# EAGLE design v1garagedoor (EAGLE 7.4.0)
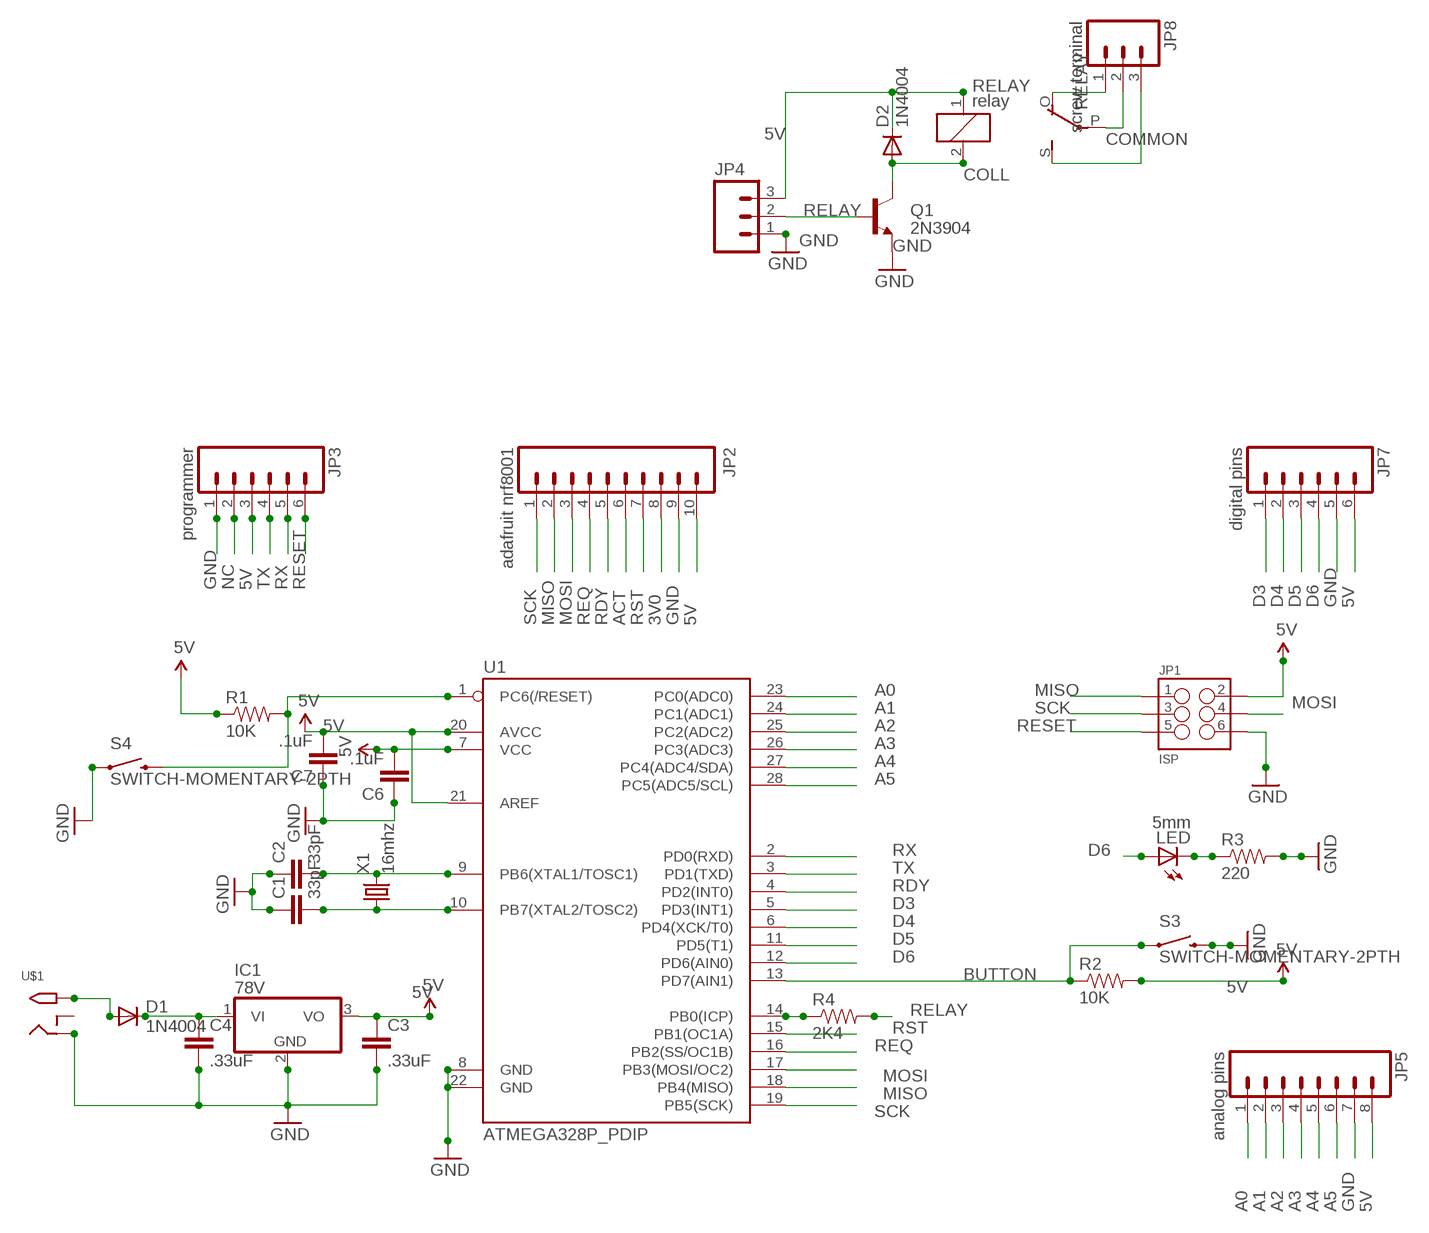
[diagram p0: schematic, sheet 1]

## Parts
C1  33pF  CAPPTH1  [CAP-PTH-5MM]
C2  33pF  CAPPTH1  [CAP-PTH-5MM]
C3  .33uF  CAPKIT  [CAP-PTH-SMALL-KIT]
C4  .33uF  CAPKIT  [CAP-PTH-SMALL-KIT]
C6  .1uF  CAPKIT  [CAP-PTH-SMALL-KIT]
C7  .1uF  CAPKIT  [CAP-PTH-SMALL-KIT]
D1  1N4004  [DO41-10]
D2  1N4004  [DO41-10]
IC1  78V  [TO220V]
JP1  ISP  M03X2NO_SILK  [2X3-NS]
JP2  adafruit nrf8001  M10SILK_FEMALE_PTH  [1X10]
JP3  programmer  M06NO_SILK_FEMALE_PTH  [1X06_NO_SILK]
JP4  M03LOCK  [1X03_LOCK]
JP5  analog pins  M08SILK_FEMALE_PTH  [1X08]
JP7  digital pins  M06NO_SILK_FEMALE_PTH  [1X06_NO_SILK]
JP8  screw terminal  M03SCREW  [SCREWTERMINAL-3.5MM-3]
LED  5mm  LED5MM  [LED5MM]
Q1  2N3904  TRANSISTOR_NPN2N3904  [TO-92]
R1  10K  RESISTORAXIAL-0.3  [AXIAL-0.3]
R2  10K  RESISTORAXIAL-0.3  [AXIAL-0.3]
R3  220  RESISTORAXIAL-0.3  [AXIAL-0.3]
R4  2K4  RESISTORAXIAL-0.3  [AXIAL-0.3]
RELAY  relay  ZF112  [ZF112]
S3  SWITCH-MOMENTARY-2PTH  [TACTILE-PTH]
S4  SWITCH-MOMENTARY-2PTH  [TACTILE-PTH]
U1  ATMEGA328P_PDIP  [DIL28-3]
U$1  2.1MMJACKTHM  [PJ-102A]
X1  16mhz  CRYSTALTC38H  [TC38H]

## Nets
3V0: JP2.8
5V: C3.1 C6.2 C7.2 D2.C IC1.3(VO) JP1.2 JP2.10 JP3.3 JP4.3 JP5.8 JP7.6 R1.P$1 R2.P$2 RELAY.1 U1.7(VCC) U1.20(AVCC) U1.21(AREF)
12V: D1.A U$1.TIP
A0: JP5.1 U1.23(PC0(ADC0))
A1: JP5.2 U1.24(PC1(ADC1))
A2: JP5.3 U1.25(PC2(ADC2))
A3: JP5.4 U1.26(PC3(ADC3))
A4: JP5.5 U1.27(PC4(ADC4/SDA))
A5: JP5.6 U1.28(PC5(ADC5/SCL))
ACT: JP2.6
BUTTON: R2.P$1 S3.1 U1.13(PD7(AIN1))
COLL: D2.A Q1.3(C) RELAY.2
COMMON: JP8.2 RELAY.P(2:P)
D3: JP7.1 U1.5(PD3(INT1))
D4: JP7.2 U1.6(PD4(XCK/T0))
D5: JP7.3 U1.11(PD5(T1))
D6: JP7.4 LED.A U1.12(PD6(AIN0))
GND: C1.1 C2.1 C3.2 C4.2 C6.1 C7.1 IC1.2(GND) JP1.6 JP2.9 JP3.1 JP4.1 JP5.7 JP7.5 Q1.1(E) R3.P$2 S3.3 S4.1 U1.8(GND) U1.22(GND) U$1.RING
MISO: JP1.1 JP2.2 U1.18(PB4(MISO))
MOSI: JP1.4 JP2.3 U1.17(PB3(MOSI/OC2))
N$1: C2.2 U1.9(PB6(XTAL1/TOSC1)) X1.2
N$2: C1.2 U1.10(PB7(XTAL2/TOSC2)) X1.1
N$3: C4.1 D1.C IC1.1(VI)
N$4: LED.K(C) R3.P$1
N$5: JP8.1 RELAY.O(2:O)
N$6: JP8.3 RELAY.S(2:S)
N$7: R4.P$1 U1.14(PB0(ICP))
NC: JP3.2
RDY: JP2.5 U1.4(PD2(INT0))
RELAY: JP4.2 Q1.2(B) R4.P$2
REQ: JP2.4 U1.16(PB2(SS/OC1B))
RESET: JP1.5 JP3.6 R1.P$2 S4.3 U1.1(PC6(/RESET))
RST: JP2.7 U1.15(PB1(OC1A))
RX: JP3.5 U1.2(PD0(RXD))
SCK: JP1.3 JP2.1 U1.19(PB5(SCK))
TX: JP3.4 U1.3(PD1(TXD))
Unconnected: U$1.RING_SW

## Library data of the parts
C1 C2 = SparkFun-Capacitors:CAP: Capacitor Standard 0603 ceramic capacitor, and 0.1" leaded capacitor.; MOUSER: 594-S200K25SL0N63L6R
C3 C4 C6 C7 = SparkFun-Capacitors:CAP: Capacitor Standard 0603 ceramic capacitor, and 0.1" leaded capacitor.; MOUSER: 810-FK18X5R1A334K
D1 D2 = adafruit:1N4004: DIODE General purpose 1N400x type rectifier (With bigger pads) http://www.ladyada.net/library/pcb/eaglelibrary.html; MOUSER: 621-1N4004
IC1 = adafruit:78*: Positive VOLTAGE REGULATOR Added bigger pads to the TO-92 package; MOUSER: 863-MC7805CTG
JP1 = SparkFun-Connectors:M03X2: 2x3 .1" header. Shrouded, with keying- CONN-10681 SMT- CONN-11415 Pogo pins- HW-11044; MOUSER: 571-5-146252-3
JP2 = SparkFun-Connectors:M10: Header 10 Standard 10-pin 0.1" header. Use with straight break away headers (SKU : PRT-00116), right angle break away headers (PRT-00553), swiss pins (PRT-00743), machine pins (PRT-00117), and female headers (PRT-00115).; MOUSER: 992-10FX1-254MM; PROD_ID: CONN-11563
JP3 JP7 = SparkFun-Connectors:M06: Header 6 Standard 6-pin 0.1" header. Use with straight break away headers (SKU : PRT-00116), right angle break away headers (PRT-00553), swiss pins (PRT-00743), machine pins (PRT-00117), and female headers (PRT-00115). Molex polarized connector foot print use with SKU : PRT-08094 with associated crimp pins and housings. NOTES ON THE VARIANTS LOCK and LOCK_LONGPADS... This footprint was designed to help hold the alignment of a through-hole component (i.e. 6-pin header) while soldering it into place. You may notice that each hole has been shifted either up or down by 0.005 of an inch from it's more standard position (which is a perfectly straight line). This slight alteration caused the pins (the squares in the middle) to touch the edges of the holes. Because they are alternating, it causes a "brace" to hold the component in place. 0.005 has proven to be the perfect amount of "off-center" position when using our standard breakaway headers. Although looks a little odd when you look at the bare footprint, once you have a header in there, the alteration is very hard to notice. Also,if you push a header all the way into place, it is covered up entirely on the bottom side. This idea of altering the position of holes to aid alignment will be further integrated into the Sparkfun Library for other footprints. It can help hold any component with 3 or more connection pins.; PROD_ID: CONN-08437
JP4 = SparkFun-Connectors:M03: Header 3 Standard 3-pin 0.1" header. Use with straight break away headers (SKU : PRT-00116), right angle break away headers (PRT-00553), swiss pins (PRT-00743), machine pins (PRT-00117), and female headers (PRT-00115). Molex polarized connector foot print use with SKU : PRT-08232 with associated crimp pins and housings.
JP5 = SparkFun-Connectors:M08: Header 8 Standard 8-pin 0.1" header. Use with straight break away headers (SKU : PRT-00116), right angle break away headers (PRT-00553), swiss pins (PRT-00743), machine pins (PRT-00117), and female headers (PRT-00115).; PROD_ID: CONN-08438
JP8 = SparkFun-Connectors:M03: Header 3 Standard 3-pin 0.1" header. Use with straight break away headers (SKU : PRT-00116), right angle break away headers (PRT-00553), swiss pins (PRT-00743), machine pins (PRT-00117), and female headers (PRT-00115). Molex polarized connector foot print use with SKU : PRT-08232 with associated crimp pins and housings.; PROD_ID: CONN-08288
LED = adafruit:LED: LED OSRAM: - CHIPLED LG R971, LG N971, LY N971, LG Q971, LY Q971, LO R971, LY R971 LH N974, LH R974 LS Q976, LO Q976, LY Q976 LO Q996 - Hyper CHIPLED LW Q18S LB Q993, LB Q99A, LB R99A - SideLED LS A670, LO A670, LY A670, LG A670, LP A670 LB A673, LV A673, LT A673, LW A673 LH A674 LY A675 LS A676, LA A676, LO A676, LY A676, LW A676 LS A679, LY A679, LG A679 - Hyper Micro SIDELED® LS Y876, LA Y876, LO Y876, LY Y876 LT Y87S - SmartLED LW L88C, LW L88S LB L89C, LB L89S, LG L890 LS L89K, LO L89K, LY L89K LS L896, LA L896, LO L896, LY L896 - TOPLED LS T670, LO T670, LY T670, LG T670, LP T670 LSG T670, LSP T670, LSY T670, LOP T670, LYG T670 LG T671, LOG T671, LSG T671 LB T673, LV T673, LT T673, LW T673 LH T674 LS T676, LA T676, LO T676, LY T676, LB T676, LH T676, LSB T676, LW T676 LB T67C, LV T67C, LT T67C, LS T67K, LO T67K, LY T67K, LW E67C LS E67B, LA E67B, LO E67B, LY E67B, LB E67C, LV E67C, LT E67C LW T67C LS T679, LY T679, LG T679 LS T770, LO T770, LY T770, LG T770, LP T770 LB T773, LV T773, LT T773, LW T773 LH T774 LS E675, LA E675, LY E675, LS T675 LS T776, LA T776, LO T776, LY T776, LB T776 LHGB T686 LT T68C, LB T68C - Hyper Mini TOPLED® LB M676 - Mini TOPLED Santana® LG M470 LS M47K, LO M47K, LY M47K Source: http://www.osram.convergy.de/
Q1 = SparkFun-DiscreteSemi:TRANSISTOR_NPN: Generic NPN BJT MMBT2222A - TRANS-08049 (SOT-23, 1A 40V) MPSA42 - TRANS-09116 (SOT-23, 500mA 300V) MMBT5088LT1G - TRANS-11160 (SOT-23, 50 mA 30V) BC547 - COM-08928 <http://www.sparkfun.com/products/8928> (TO-92 45V 100mA) (1.Collector 2.Base 3.Emitter) 2N3904 - COM-00521 <http://www.sparkfun.com/products/521> (TO-92 40V 200mA) (1.Emitter 2.Base 3.Collector) P2N2222A - COM-12852 <http://www.sparkfun.com/products/12852> (TO-92 40V 600mA) (1.Collector 2.Base 3.Emitter); MOUSER: 610-2N3904; PROD_ID: TRANS-08447
R1 R2 = SparkFun-Resistors:RESISTOR: Resistor Basic schematic elements and footprints for 0603, 1206, and PTH resistors.; MOUSER: 603-CFR-25JR-5210K
R3 = SparkFun-Resistors:RESISTOR: Resistor Basic schematic elements and footprints for 0603, 1206, and PTH resistors.; MOUSER: 603-CFR-25JR-52220R
R4 = SparkFun-Resistors:RESISTOR: Resistor Basic schematic elements and footprints for 0603, 1206, and PTH resistors.; MOUSER: 603-CFR-25JR-52-680R
RELAY = relay:ZF112: RELAY 1 x switch; MOUSER: 655-ORWH-SH105D1F000; OC_FARNELL: unknown; OC_NEWARK: unknown
S3 S4 = SparkFun-Electromechanical:SWITCH-MOMENTARY-2: Various NO switches- pushbuttons, reed, etc; MOUSER: 693-1301.9301; PROD_ID: SWCH-08441
U1 = SparkFun-DigitalIC:ATMEGA328P_PDIP: uC used in the Arduino 32kb flash, 1k EEPROM, 2k SRAM This is the through-hole version of this chip.; MOUSER: 556-ATMEGA328P-PU
U$1 = adafruit:2.1MMJACK: 2.1mm x 5.5mm THM DC jack with internal switch. Digikey part #PJ-102A, 4UCON part #05537 2.1mm x 5.5mm SMT DC jack with internal switch. Digikey part #PJ-002A-SMT, 4UCON part #03267 By microbuilder.eu & adafruit.com; MOUSER: 992-CON-SOCJ-2155
X1 = SparkFun-FreqCtrl:CRYSTAL: Various standard crystals. Proven footprints.; MOUSER: 520-160-20-46X

## Net classes
0 default: width 0.254 mm

## Board
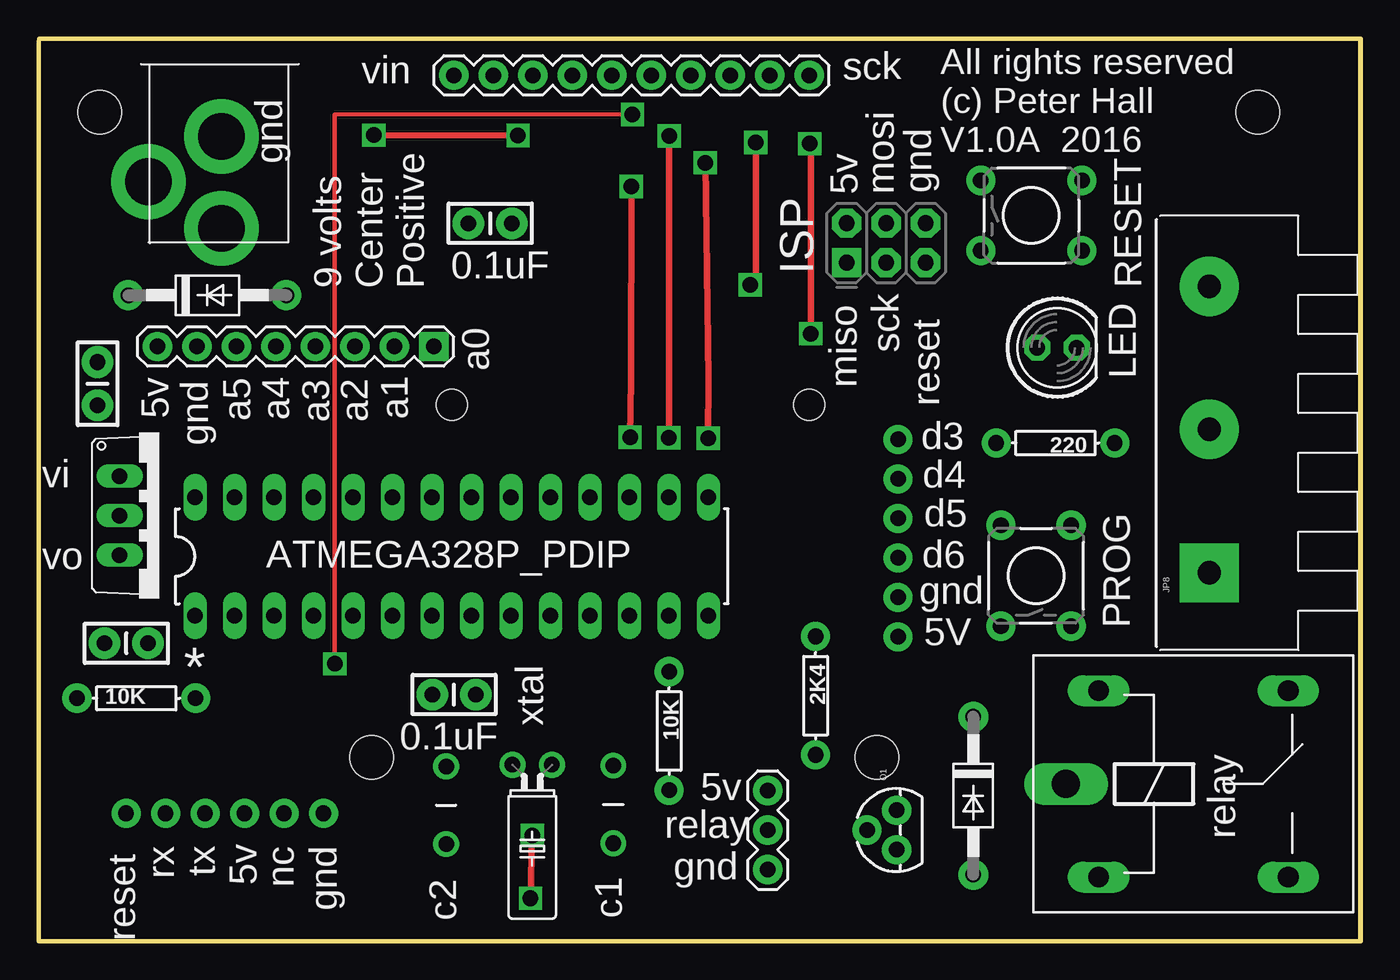
[diagram p1: board, top side]
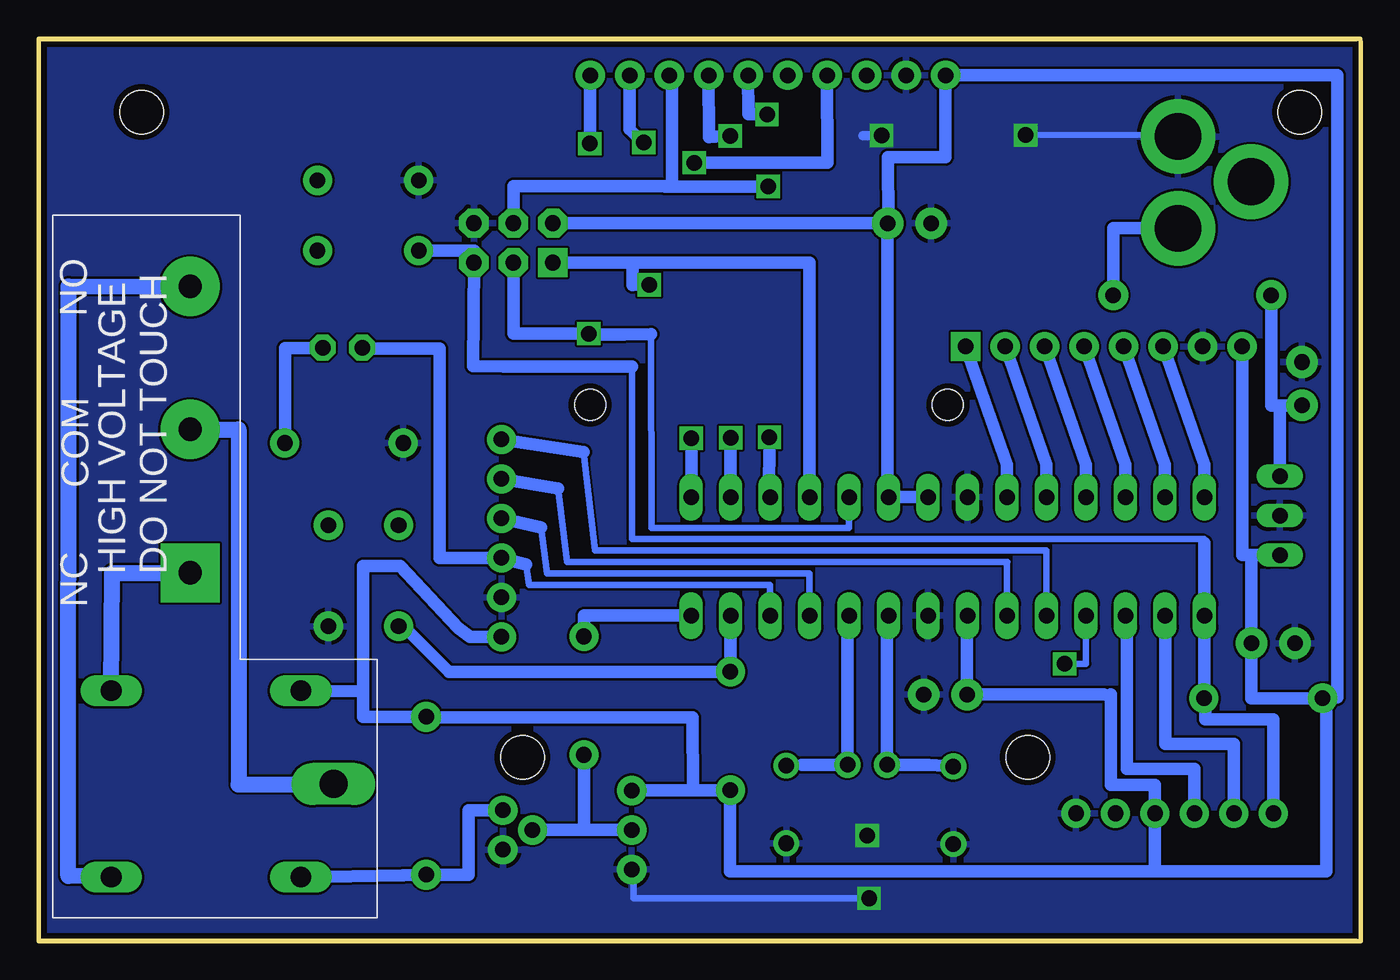
[diagram p2: board, bottom side, seen from below]

Size 85.02 x 58.04 mm. Coordinates in mm from the lower left corner, seen from the top.
Outline: 0.01,58.04 85.02,58.03 85.02,0 0,0 0.01,57.88
Copper layers (1*16): Top 0.0356mm / dielectric 1.5011mm / Bottom 0.0356mm
Design rules "LaenPCBOrder": minimum track width 6mil, minimum drill 13mil, track to track 6mil, track to pad 6mil, pad to pad 6mil, via to via 6mil, smd to smd 6mil, copper to edge 15mil, drill to drill 6mil, minimum pad ring 7mil, minimum via ring 7mil, stop-mask expansion 3mil, vias tented up to drill 0mil, thermal gap 10mil
Holes 2.8 mm at 3.91,53.33 21.41,11.83 53.91,11.83 78.41,53.33
Holes 2 mm at 49.56,34.49 26.56,34.49
Milling: 3 lines

### Footprints (pad centres in the part's own frame; a part is rotated, then mirrored left to right if it is on the bottom)
CAP-PTH-5MM = drill 1 pad 1.651: 1 -2.5,0; 2 2.5,0
CAP-PTH-SMALL-KIT = drill 1 pad 2.032: 1 -1.397,0; 2 1.397,0
DO41-10 = drill 1 pad 1.93: A 5.08,0; C -5.08,0
TO220V = drill 1 long: 1 -2.54,-2.54; 2 0,-2.54; 3 2.54,-2.54
2X3-NS = drill 1 pad 1.88 square: 1 -2.54,-1.27 | drill 1 pad 1.88 octagon: 2 -2.54,1.27; 3 0,-1.27; 4 0,1.27; 5 2.54,-1.27; 6 2.54,1.27
1X10 = drill 1 pad 1.88: 1 0,0; 2 2.54,0; 3 5.08,0; 4 7.62,0; 5 10.16,0; 6 12.7,0; 7 15.24,0; 8 17.78,0; 9 20.32,0; 10 22.86,0
1X06_NO_SILK = drill 1 pad 1.88: 1 0,0; 2 2.54,0; 3 5.08,0; 4 7.62,0; 5 10.16,0; 6 12.7,0
1X03_LOCK = drill 1 pad 1.88: 1 0,0; 2 2.54,0; 3 5.08,0
1X08 = drill 1 pad 1.88 square: 1 0,0 | drill 1 pad 1.88: 2 2.54,0; 3 5.08,0; 4 7.62,0; 5 10.16,0; 6 12.7,0; 7 15.24,0; 8 17.78,0
SCREWTERMINAL-3.5MM-3 = drill 1.5 pad 3.81 square: 1 -9,7 | drill 1.5 pad 3.81: 2 0.23,7; 3 9.43,7
LED5MM = drill 1 pad 1.676 octagon: A -1.27,0; K 1.27,0
TO-92 = drill 1 pad 1.88: 1 -1.27,0; 2 0,1.905; 3 1.27,0
AXIAL-0.3 = drill 1 pad 1.88: P$1 -3.81,0; P$2 3.81,0
ZF112 = drill 1.321 long: 1 -6.096,5.994; 2 -6.096,-5.994; O 6.096,5.994; S 6.096,-5.994 | drill 1.803 long: P -8.204,0
TACTILE-PTH = drill 1 pad 1.88: 1 -3.251,2.261; 2 3.251,2.261; 3 -3.251,-2.261; 4 3.251,-2.261
DIL28-3 = drill 1 long: 1 -16.51,-3.81; 2 -13.97,-3.81; 3 -11.43,-3.81; 4 -8.89,-3.81; 5 -6.35,-3.81; 6 -3.81,-3.81; 7 -1.27,-3.81; 8 1.27,-3.81; 9 3.81,-3.81; 10 6.35,-3.81; 11 8.89,-3.81; 12 11.43,-3.81; 13 13.97,-3.81; 14 16.51,-3.81; 15 16.51,3.81; 16 13.97,3.81; 17 11.43,3.81; 18 8.89,3.81; 19 6.35,3.81; 20 3.81,3.81; 21 1.27,3.81; 22 -1.27,3.81; 23 -3.81,3.81; 24 -6.35,3.81; 25 -8.89,3.81; 26 -11.43,3.81; 27 -13.97,3.81; 28 -16.51,3.81
PJ-102A = drill 3 pad 4.8: RING 0.1,-3.39; RING_SW -4.6,-6.29; TIP 0.1,-9.29
TC38H = drill 1 pad 1.676: 1 -1.27,0; 2 1.27,0

### Placement (x,y rotation side)
C1  36.94,8.79 90 top
C2  26.2,8.73 90 top
C3  5.63,19.16 180 top
C4  3.77,35.85 90 top
C6  26.71,15.86 180 top
C7  29.03,46.17 0 top
D1  10.84,41.55 0 top
D2  60.1,9.35 270 top
IC1  7.74,27.37 270 top
JP1  54.49,44.91 0 top
JP2  49.56,55.7 180 top
JP3  18.31,8.22 180 top
JP4  46.89,4.6 90 top
JP5  25.41,38.25 180 top
JP7  55.26,32.27 270 top
JP8  82.28,32.69 90 top
LED  65.49,38.18 0 top
Q1  55.17,7.14 90 top
R1  6.27,15.62 0 top
R2  40.54,13.52 270 top
R3  65.39,32.04 180 top
R4  49.96,15.79 270 top
RELAY  74.27,10.11 0 top
S3  64.14,23.51 90 top
S4  63.84,46.68 0 top
U1  26.55,24.75 0 top
U$1  11.64,55.14 0 top
X1  31.74,11.35 180 top

### Tracks (layer width: path | path; a pad name or v marks a point on that pad's centre or on a via)
5V
  Bottom 0.406: U1.21 U1.20 | 30.44,45.38 C7.2 30.38,46.18 30.38,46.15 | 5.56,55.69 5.49,55.72 | JP3.3 13.26,8.22 | U1.7 25.31,20.94 | 16.52,15.86 16.05,15.86 | 42.95,9.71 42.95,9.7 42.95,9.68 | 60.1,14.4 D2.C 62.65,14.43 | 64.15,16.05 64.15,15.15 | 26.37,55.7 JP2.10 | R1.P$1 2.22,15.62 2.22,15.66 1.5,15.66 | R2.P$2 40.56,9.71 | 13.24,5.95 13.23,5.95 | 64.15,22.24
  Bottom 0.813: 30.38,46.15 30.41,50.42 26.69,50.42 JP2.10 | 60.1,14.4 42.96,14.4 42.95,9.7 | JP7.6 57.3,19.57 58.04,20.15 61.78,24.12 64.15,24.14 64.15,22.24 64.15,15.15 | 1.5,15.66 1.49,49.62 1.49,55.7 5.56,55.69 | 5.49,55.72 26.37,55.7 | U1.21 30.43,28.56 C7.2 | 25.31,20.94 C6.2 16.52,15.86 | 16.05,15.86 16.05,10.06 13.23,10.06 JP3.3 13.23,5.95 | R2.P$2 42.95,9.71 | JP4.3 42.95,9.68 | RELAY.1 64.15,16.05 | D2.C 64.15,14.43 64.15,15.15 | JP1.2 C7.2 | 2.22,15.62 2.22,4.49 13.24,4.49 | R1.P$1 7.02,15.62 C3.1 7.02,24.83 | 7.02,24.83 IC1.3 | JP5.8 7.63,24.83 7.02,24.83 | 40.56,9.71 40.56,4.49 13.24,4.49 | 13.24,5.95 13.24,4.49
12V
  Bottom 0.813: D1.A 15.91,45.86 U$1.TIP
A0
  Bottom 0.813: U1.23 22.74,30.67 JP5.1
A1
  Bottom 0.813: U1.24 20.2,30.67 JP5.2
A2
  Bottom 0.813: U1.25 17.66,30.67 JP5.3
A3
  Bottom 0.813: U1.26 15.12,30.67 JP5.4
A4
  Bottom 0.813: U1.27 12.58,30.67 JP5.5
A5
  Bottom 0.813: U1.28 10.04,30.67 JP5.6
BUTTON
  Bottom 0.406: U1.13 40.54,20.94 | R2.P$1
  Bottom 0.813: 40.54,20.94 R2.P$1 | S3.1 61.56,20.25 58.63,17.32 R2.P$1
COLL
  Bottom 0.813: Q1.3 57.37,8.42 57.37,7.21 57.38,4.27 D2.A 61.6,4.23 RELAY.2
  Bottom 1.016: D2.A 60.19,4.4
COMMON
  Bottom 0.406: 66.06,10.07 RELAY.P
  Bottom 1.016: JP8.2 72.17,32.92 72.17,10.07 66.06,10.07
D3
  Bottom 0.254: 49.25,25.12 49.25,25.32 49.24,25.11
  Bottom 0.406: 49.24,25.11 20.23,25.11 20.2,25.12 U1.5 | 49.25,25.12 50,31.45 | JP7.1
  Bottom 0.813: 50,31.45 JP7.1
D4
  Bottom 0.406: 51.61,29.11 51.06,24.38 22.73,24.38 22.74,24.36 U1.6 | JP7.2
  Bottom 0.813: 51.61,29.11 JP7.2
D5
  Bottom 0.406: U1.11 35.44,23.64 52.32,23.64 52.73,26.6 | JP7.3
  Bottom 0.813: 52.73,26.6 JP7.3
D6
  Bottom 0.406: U1.12 37.98,22.9 53.49,22.9 53.67,24.21 | 55.26,24.63 JP7.4 | 64.22,38.1 LED.A
  Bottom 0.813: 53.67,24.21 55.26,24.63 | JP7.4 59.25,24.65 59.25,38.1 64.22,38.1
GND  (via drill 1)
  Top 0.406: v31.62,2.75 v31.73,6.78 | v21.56,51.85 v30.82,51.83
  Bottom 0.406: JP4.1 46.78,3.55 46.78,2.75 v31.62,2.75 | U$1.RING 11.63,51.87 v21.56,51.85
  Bottom 0.61: v30.82,51.83 32,51.79
  Bottom 0.813: U1.22 25.12,28.56
  pour Bottom: 0.49,57.59 84.64,57.59 84.56,0.33 0.41,0.33
MISO  (via drill 1)
  Top 0.406: v46.12,51.38 46.12,42.57 v45.76,42.22
  Bottom 0.406: 46.84,43.64 46.87,43.64 | 46.2,51.38 v46.12,51.38
  Bottom 0.813: JP1.1 46.84,43.64 46.84,42.19 v45.76,42.22 | 46.87,43.64 35.44,43.64 U1.18 | JP2.2 47.04,52.22 46.2,51.38
MOSI  (via drill 1)
  Top 0.406: v38.03,32.41 38.09,36.08 v38.11,48.54
  Bottom 0.406: 44.74,48.56 44.3,48.6 44.74,48.54 | U1.17 38.06,28.56 | JP2.3 44.3,55.7
  Bottom 0.813: 44.74,48.56 54.49,48.57 JP1.4 | 38.06,28.56 v38.03,32.41 | v38.11,48.54 44.74,48.54 | 44.3,55.7 44.3,48.6
N$1
  Bottom 0.406: U1.9 30.47,20.94
  Bottom 0.813: 30.47,20.94 X1.2 27.79,11.35 C2.2
N$2
  Bottom 0.406: U1.10 33.01,20.94 | 35.95,11.35 C1.2
  Bottom 0.813: 33.01,20.94 X1.1 35.95,11.35
N$3
  Bottom 0.813: IC1.1 5.2,34.45 | 5.2,34.45 C4.1 | D1.C 5.76,34.45 5.2,34.45
N$4
  Bottom 0.406: R3.P$1 69.18,32.04 | 66.76,38.13 LED.K
  Bottom 0.813: 69.18,32.04 69.18,38.13 66.76,38.13
N$5
  Bottom 1.016: RELAY.O 80.3,23.68 JP8.1
N$6
  Bottom 1.016: RELAY.S 81.64,4.17 83.12,4.2 83.11,42.12 JP8.3
N$7
  Bottom 0.813: U1.14 49.96,20.94 R4.P$1
RDY  (via drill 1)
  Top 0.305: v38.18,53.18 19.04,53.16 v19.04,17.83
  Bottom 0.406: v19.04,17.83 17.66,17.83 U1.4
  Bottom 0.813: JP2.5 39.38,53.18 v38.18,53.18
RELAY
  Bottom 0.813: JP4.2 49.96,7.14 | 49.96,7.14 R4.P$2 | Q1.2 49.96,7.14
REQ  (via drill 1)
  Top 0.406: v40.55,51.8 v40.52,32.37
  Bottom 0.813: U1.16 v40.52,32.37 | v40.55,51.8 41.93,51.72 JP2.4
RESET
  Bottom 0.406: 46.87,36.96 46.87,25.85 10.07,25.85 10.05,25.61 | 10.04,15.62 R1.P$2 9.99,15.62
  Bottom 0.813: JP3.6 5.61,14.26 9.99,14.26 9.99,15.62 | 46.87,36.96 55.14,36.96 57.08,36.98 JP1.5 57.03,44.42 S4.3 | 10.05,25.61 U1.1 10.04,15.62
RST  (via drill 1)
  Top 0.406: v43.05,32.35 43.06,36.16 v42.87,50.07
  Bottom 0.406: U1.15 43.01,28.56
  Bottom 0.813: v42.87,50.07 34.31,50.07 JP2.7 | U1.15 v43.05,32.35
RX
  Bottom 0.813: U1.2 12.58,12.68 8.15,12.68 JP3.5
  Bottom 1.016: U1.2
SCK  (via drill 1)
  Top 0.406: v49.58,51.3 49.65,51.36 v49.65,39.08 | v49.65,39.08
  Bottom 0.406: U1.19 32.9,26.59 45.62,26.59 45.65,39.03 | 49.22,39.02 v49.65,39.08
  Bottom 0.813: JP2.1 v49.58,51.3 | v49.65,39.08 54.48,39.08 JP1.3 | 49.22,39.02 47.37,39.02 45.65,39.03
TX
  Bottom 0.813: 15.03,20.94 15.03,11.06 10.69,11.06 JP3.4
  Bottom 1.016: U1.3 15.03,20.94

### Text on the board
_tsilk: vin | sck | All rights reserved / (c) Peter Hall / V1.0A 2016 | gnd | RESET | 5v | mosi | gnd | 0.1uF | 9 volts / Center / Positive | sck | a0 | miso | reset | 5v | a5 | a4 | a1 | a3 | a2 | gnd | d3 | vi | d4 | PROG | d5 | vo | d6 | gnd | 5V | * | xtal | 0.1uF | 5v | relay | rx | tx | 5v | nc | gnd | gnd | c1 | c2 | reset
_bsilk: NO | COM | HIGH VOLTAGE / DO NOT TOUCH | NC